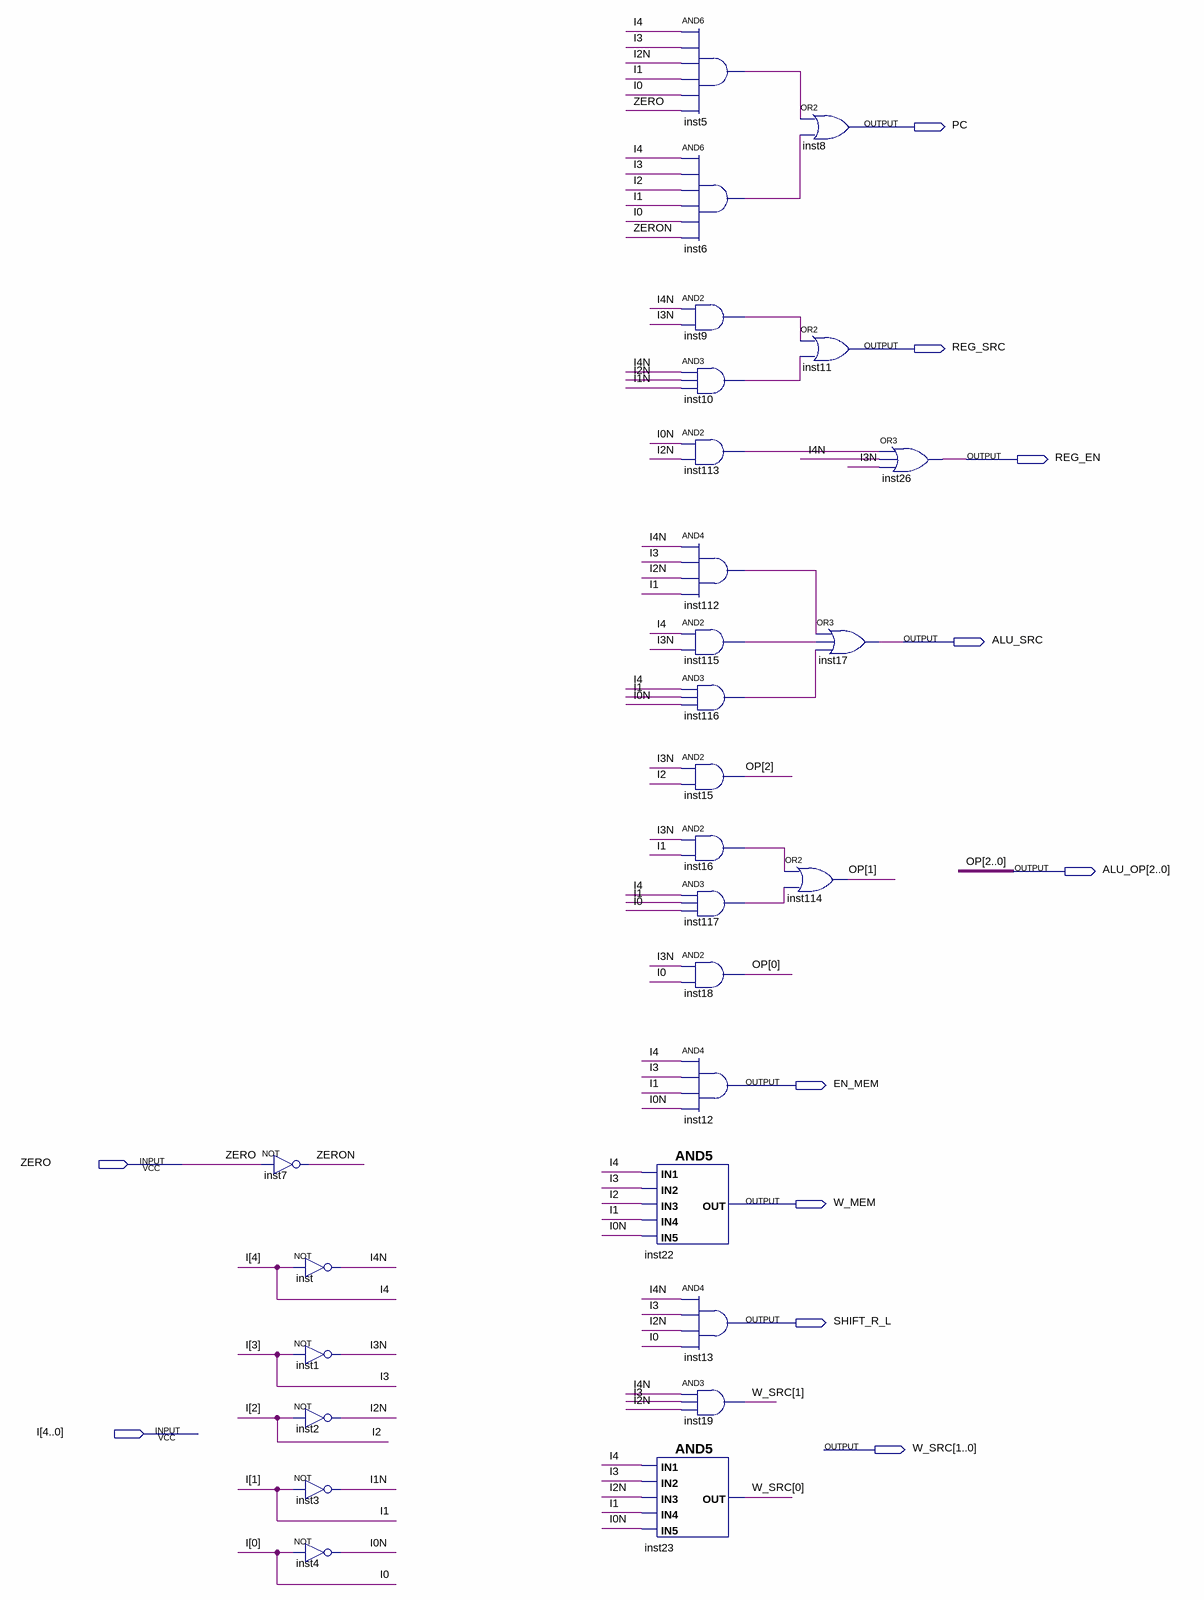
[diagram p0: schematic sheet]
// Quartus schematic CONTROLV1.bdf as structural Verilog: 28 symbols, 11 pins
module CONTROLV1 (
  input  ZERO,
  input  [4:0] I,
  output PC,
  output REG_SRC,
  output REG_EN,
  output ALU_SRC,
  output [2:0] ALU_OP,
  output EN_MEM,
  output W_MEM,
  output SHIFT_R_L,
  output [1:0] W_SRC
);

  wire I0N, I1N, I2N, I3N, I4N, inst5_out, inst6_out, inst9_out, inst10_out, inst16_out, inst112_out,
       inst113_out, inst115_out, inst116_out, inst117_out, ZERON;

  not inst7 (ZERON, ZERO);
  not inst (I4N, I[4]);
  not inst1 (I3N, I[3]);
  not inst2 (I2N, I[2]);
  not inst3 (I1N, I[1]);
  not inst4 (I0N, I[0]);
  and inst22 (W_MEM, I[4], I[3], I[2], I[1], I0N);
  and inst23 (W_SRC[0], I[4], I[3], I2N, I[1], I0N);
  and inst5 (inst5_out, I[4], I[3], I2N, I[1], I[0], ZERO);
  and inst6 (inst6_out, I[4], I[3], I[2], I[1], I[0], ZERON);
  and inst9 (inst9_out, I4N, I3N);
  and inst10 (inst10_out, I4N, I2N, I1N);
  and inst113 (inst113_out, I0N, I2N);
  and inst112 (inst112_out, I4N, I[3], I2N, I[1]);
  and inst115 (inst115_out, I[4], I3N);
  and inst116 (inst116_out, I[4], I[1], I0N);
  and inst15 (ALU_OP[2], I3N, I[2]);
  and inst16 (inst16_out, I3N, I[1]);
  and inst117 (inst117_out, I[4], I[1], I[0]);
  and inst18 (ALU_OP[0], I3N, I[0]);
  and inst12 (EN_MEM, I[4], I[3], I[1], I0N);
  and inst13 (SHIFT_R_L, I4N, I[3], I2N, I[0]);
  and inst19 (W_SRC[1], I4N, I[3], I2N);
  or inst114 (ALU_OP[1], inst16_out, inst117_out);
  or inst8 (PC, inst5_out, inst6_out);
  or inst11 (REG_SRC, inst9_out, inst10_out);
  or inst17 (ALU_SRC, inst112_out, inst115_out, inst116_out);
  or inst26 (REG_EN, inst113_out, I4N, I3N);

  // Other names for the same wires on the sheet: OP[2:0] = ALU_OP
endmodule
